# Altium schematic sheet esp32_c6_a1_top.SchDoc: Top Sheet
size A3; DrawnBy: Ali Fatih Demir; SheetNumber: 1; SheetTotal: 4
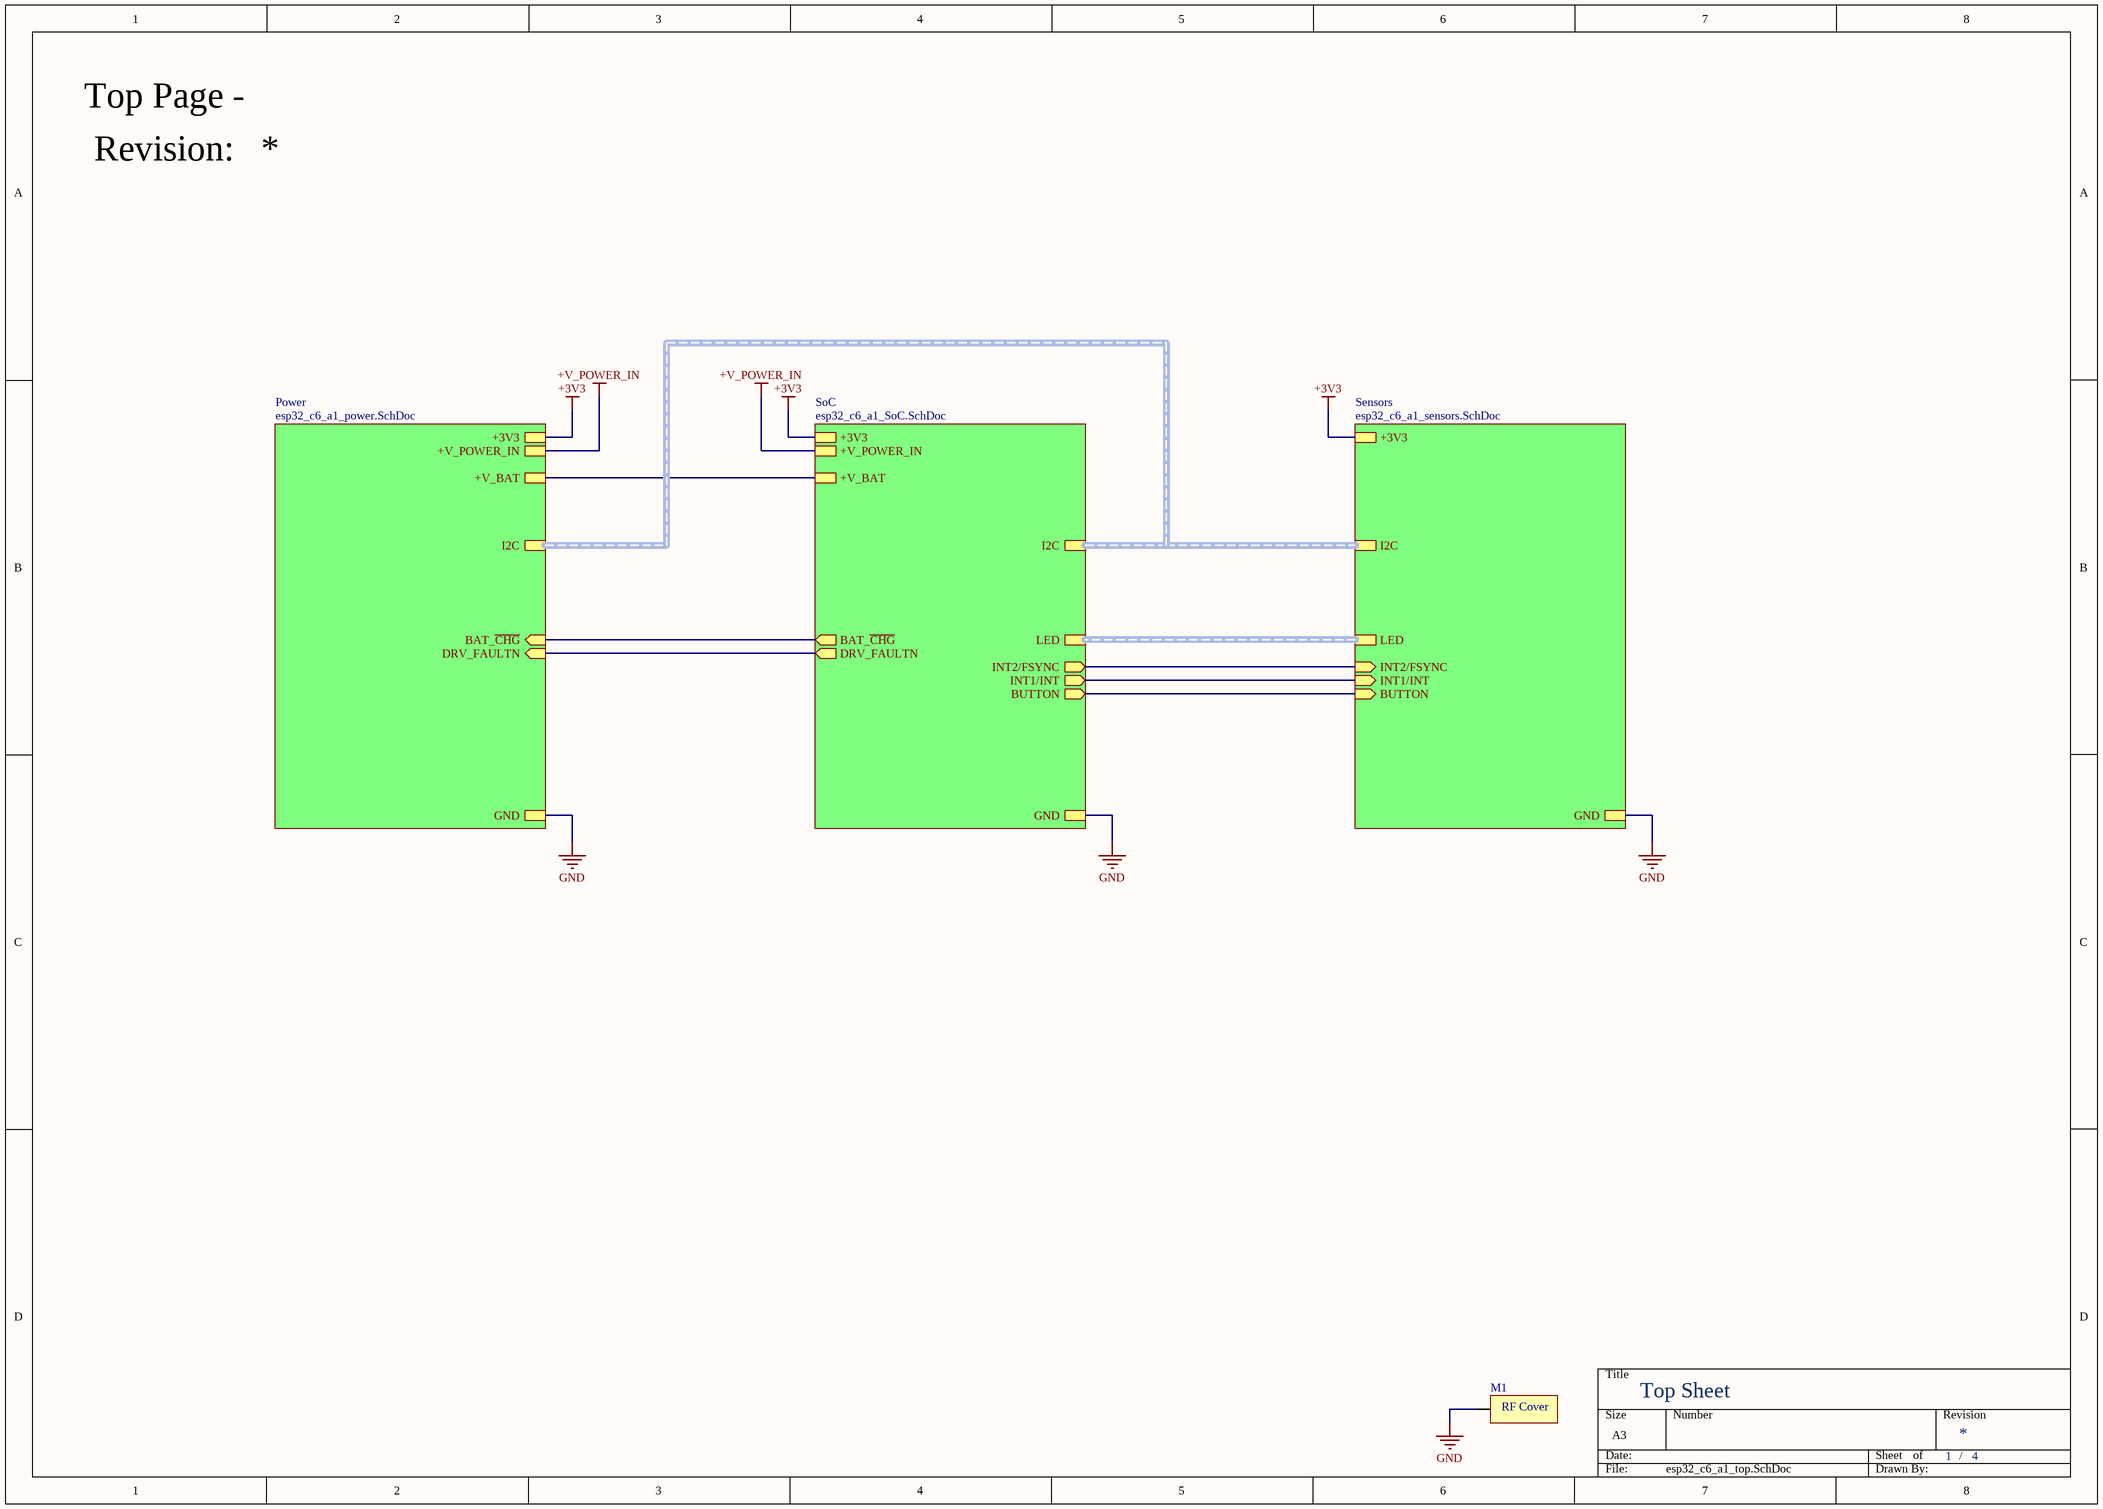
[diagram p0: esp32_c6_a1_top.SchDoc]

## Parts
M1  RF_COVER  [rf-cover]  (value not drawn)

## Sub-sheets
Power = esp32_c6_a1_power.SchDoc: I2C (harness I2C), +V_BAT, GND, BAT_~{CHG} (in), DRV_FAULTN (in), +3V3, +V_POWER_IN
Sensors = esp32_c6_a1_sensors.SchDoc: +3V3, I2C (harness I2C), GND, LED (harness LED), INT2/FSYNC (in), INT1/INT (in), BUTTON (in)
SoC = esp32_c6_a1_SoC.SchDoc: +V_BAT, GND, BAT_~{CHG} (out), DRV_FAULTN (out), +3V3, LED (harness LED), INT2/FSYNC (out), INT1/INT (out), BUTTON (out), I2C (harness I2C), +V_POWER_IN

## Nets
+3V3: sheet SoC/+3V3, sheet Power/+3V3, sheet Sensors/+3V3
+V_POWER_IN: sheet SoC/+V_POWER_IN, sheet Power/+V_POWER_IN
GND: M1.MH0(MH) ; sheet SoC/GND, sheet Power/GND, sheet Sensors/GND
(unnamed): sheet SoC/+V_BAT, sheet Power/+V_BAT
(unnamed): sheet SoC/BAT_~{CHG}, sheet Power/BAT_~{CHG}
(unnamed): sheet SoC/DRV_FAULTN, sheet Power/DRV_FAULTN
(unnamed): sheet SoC/INT2/FSYNC, sheet Sensors/INT2/FSYNC
(unnamed): sheet SoC/INT1/INT, sheet Sensors/INT1/INT
(unnamed): sheet SoC/BUTTON, sheet Sensors/BUTTON

## Buses and harness runs
harness sheet Power/I2C = sheet Sensors/I2C = sheet SoC/I2C
harness sheet Sensors/LED = sheet SoC/LED

## Notes on the sheet
- Top Page -
- Revision:
- /

## Library data of the parts
M1 = RF_COVER: RF Cover; pin to pad: MH0>MH0+MH1+MH2+MH3+MH4; Manufacturer: TBD; MPN: TBD